# Altium schematic sheet Distortion_outputbuffer.SchDoc
size A; DocumentNumber: 5; SheetNumber: 5; SheetTotal: 5
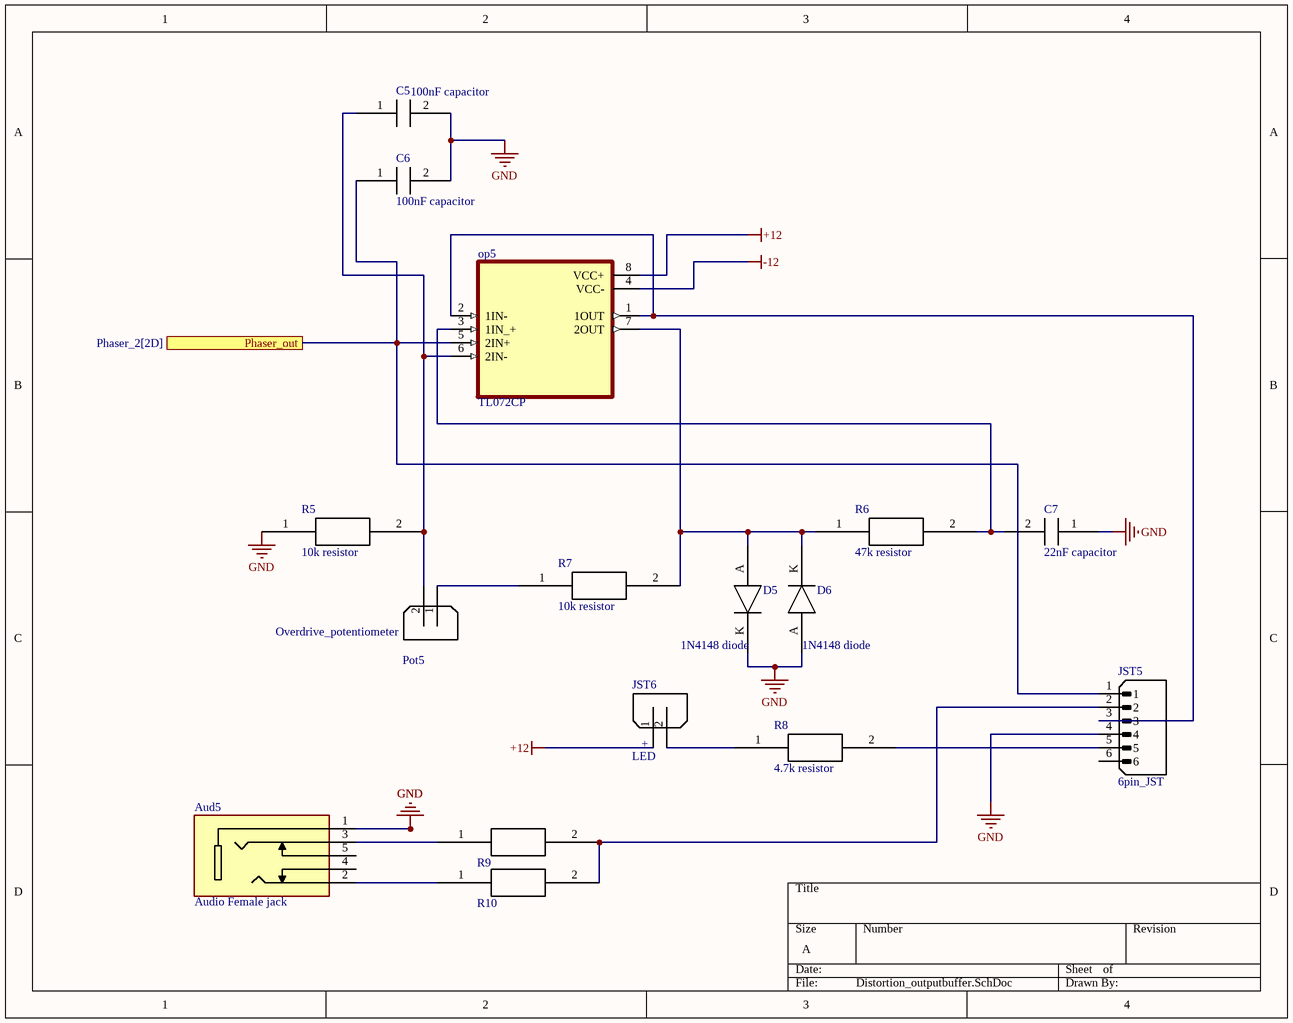
[diagram p0: Distortion_outputbuffer.SchDoc]

## Parts
Aud5  Audio Female jack  [Audio Female Jack]
C5  100nF capacitor  [100nF]
C6  100nF capacitor  [100nF]
C7  22nF capacitor  [22nF]
D5  1N4148 diode  [1N4148]
D6  1N4148 diode  [1N4148]
JST5  6pin_JST  [6pin_JST]
JST6  LED  [2pin_JST]
op5  TL072CP  [TL072CP]
Pot5  Overdrive_potentiometer  [2pin_JST_non_polarized]
R5  10k resistor  [10k]
R6  47k resistor  [47k]
R7  10k resistor  [10k]
R8  4.7k resistor  [4.7k]
R9  100ohm resistor  [100]  (value not drawn)
R10  100ohm resistor  [100]  (value not drawn)

## Ports
Phaser_out (see Phaser_2[2D])

## Nets
+12: JST6.1 op5.8(VCC+)
-12: op5.4(VCC-)
GND: Aud5.1 C5.2 C6.2 C7.1 D5.K D6.A JST5.4 R5.1
Phaser_out: C6.1 JST5.1 op5.5(2IN+) ; port Phaser_out
NetAud5_2: Aud5.2 R10.1
NetAud5_3: Aud5.3 R9.1
NetC5_1: C5.1 op5.6(2IN-) Pot5.2 R5.2
NetC7_2: C7.2 op5.3(1IN_+) R6.2
NetD5_A: D5.A D6.K op5.7(2OUT) R6.1 R7.2
NetJST5_2: JST5.2 R9.2 R10.2
NetJST5_3: JST5.3 op5.1(1OUT) op5.2(1IN-)
NetJST5_5: JST5.5 R8.2
NetJST6_2: JST6.2 R8.1
NetPot5_1: Pot5.1 R7.1

Not connected (* = marked no-connect by the designer): Aud5 4 5; JST5 6

## Notes on the sheet
- (in symbol 2pin_JST) +

## Library data of the parts
JST6 = 2pin_JST
Pot5 = 2pin_jst_non_polarized